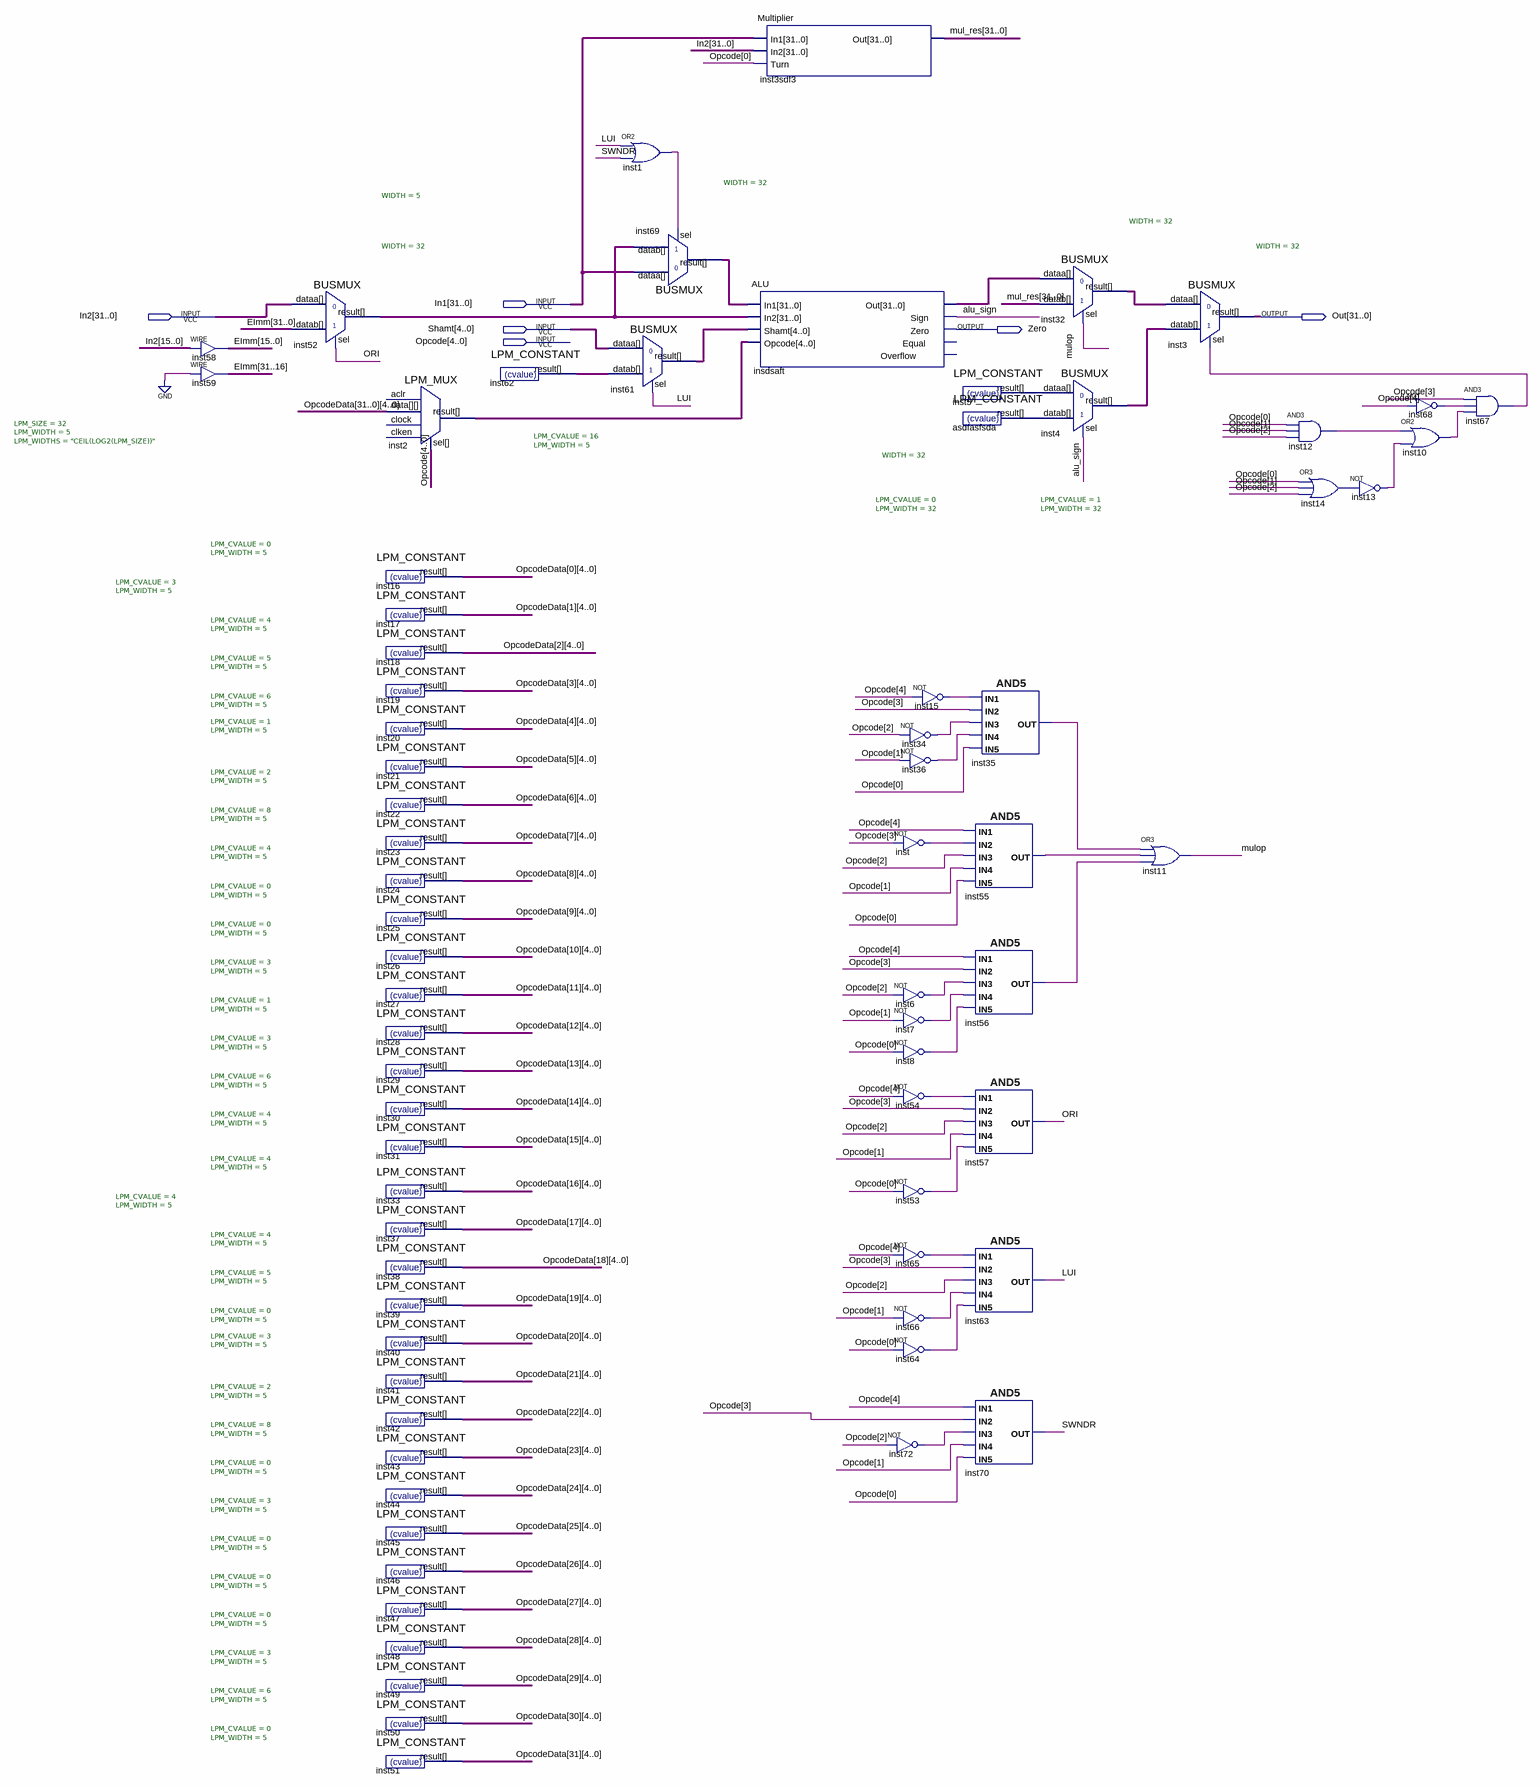
[diagram p0: schematic sheet]
// Quartus schematic ExtendedALU.bdf as structural Verilog: 73 symbols, 6 pins
module ExtendedALU (
  input  [31:0] In1,
  input  [31:0] In2,
  input  [4:0] Shamt,
  input  [4:0] Opcode,
  output [31:0] Out,
  output Zero
);

  wire alu_sign, inst1_out, inst6_out, inst7_out, inst8_out, inst10_out, inst12_out, inst13_out, inst14_out,
       inst15_out, inst34_out, inst35_out, inst36_out, inst53_out, inst54_out, inst55_out, inst56_out,
       inst64_out, inst65_out, inst66_out, inst67_out, inst68_out, inst72_out, inst_out, LUI, mulop, ORI,
       SWNDR;
  wire [4:0] inst2_result, inst61_result, inst62_result, OpcodeData_0, OpcodeData_1, OpcodeData_2,
       OpcodeData_3, OpcodeData_4, OpcodeData_5, OpcodeData_6, OpcodeData_7, OpcodeData_8, OpcodeData_9,
       OpcodeData_10, OpcodeData_11, OpcodeData_12, OpcodeData_13, OpcodeData_14, OpcodeData_15,
       OpcodeData_16, OpcodeData_17, OpcodeData_18, OpcodeData_19, OpcodeData_20, OpcodeData_21,
       OpcodeData_22, OpcodeData_23, OpcodeData_24, OpcodeData_25, OpcodeData_26, OpcodeData_27,
       OpcodeData_28, OpcodeData_29, OpcodeData_30, OpcodeData_31;
  wire [31:0] asdfasfsda_result, EImm, insdsaft_out, inst4_result, inst5_result, inst32_result,
       inst52_result, inst69_result, mul_res;

  assign EImm[15:0] = In2[15:0];  // WIRE inst58
  assign EImm[31:16] = {16{1'b0}};  // WIRE inst59
  BUSMUX #(.WIDTH(32)) inst52 (.datab(EImm), .sel(ORI), .dataa(In2), .result(inst52_result));
  LPM_CONSTANT #(.LPM_CVALUE(0), .LPM_WIDTH(5)) inst16 (.result(OpcodeData_0));
  LPM_CONSTANT #(.LPM_CVALUE(3), .LPM_WIDTH(5)) inst17 (.result(OpcodeData_1));
  LPM_CONSTANT #(.LPM_CVALUE(4), .LPM_WIDTH(5)) inst18 (.result(OpcodeData_2));
  LPM_CONSTANT #(.LPM_CVALUE(5), .LPM_WIDTH(5)) inst19 (.result(OpcodeData_3));
  LPM_CONSTANT #(.LPM_CVALUE(6), .LPM_WIDTH(5)) inst20 (.result(OpcodeData_4));
  LPM_CONSTANT #(.LPM_CVALUE(1), .LPM_WIDTH(5)) inst21 (.result(OpcodeData_5));
  LPM_CONSTANT #(.LPM_CVALUE(2), .LPM_WIDTH(5)) inst22 (.result(OpcodeData_6));
  LPM_CONSTANT #(.LPM_CVALUE(8), .LPM_WIDTH(5)) inst23 (.result(OpcodeData_7));
  LPM_CONSTANT #(.LPM_CVALUE(4), .LPM_WIDTH(5)) inst24 (.result(OpcodeData_8));
  LPM_CONSTANT #(.LPM_CVALUE(0), .LPM_WIDTH(5)) inst25 (.result(OpcodeData_9));
  LPM_CONSTANT #(.LPM_CVALUE(0), .LPM_WIDTH(5)) inst26 (.result(OpcodeData_10));
  LPM_CONSTANT #(.LPM_CVALUE(3), .LPM_WIDTH(5)) inst27 (.result(OpcodeData_11));
  LPM_CONSTANT #(.LPM_CVALUE(1), .LPM_WIDTH(5)) inst28 (.result(OpcodeData_12));
  LPM_CONSTANT #(.LPM_CVALUE(3), .LPM_WIDTH(5)) inst29 (.result(OpcodeData_13));
  LPM_CONSTANT #(.LPM_CVALUE(6), .LPM_WIDTH(5)) inst30 (.result(OpcodeData_14));
  LPM_CONSTANT #(.LPM_CVALUE(4), .LPM_WIDTH(5)) inst31 (.result(OpcodeData_15));
  LPM_CONSTANT #(.LPM_CVALUE(4), .LPM_WIDTH(5)) inst33 (.result(OpcodeData_16));
  LPM_CONSTANT #(.LPM_CVALUE(4), .LPM_WIDTH(5)) inst37 (.result(OpcodeData_17));
  LPM_CONSTANT #(.LPM_CVALUE(4), .LPM_WIDTH(5)) inst38 (.result(OpcodeData_18));
  LPM_CONSTANT #(.LPM_CVALUE(5), .LPM_WIDTH(5)) inst39 (.result(OpcodeData_19));
  LPM_CONSTANT #(.LPM_CVALUE(0), .LPM_WIDTH(5)) inst40 (.result(OpcodeData_20));
  LPM_CONSTANT #(.LPM_CVALUE(3), .LPM_WIDTH(5)) inst41 (.result(OpcodeData_21));
  LPM_CONSTANT #(.LPM_CVALUE(2), .LPM_WIDTH(5)) inst42 (.result(OpcodeData_22));
  LPM_CONSTANT #(.LPM_CVALUE(8), .LPM_WIDTH(5)) inst43 (.result(OpcodeData_23));
  LPM_CONSTANT #(.LPM_CVALUE(0), .LPM_WIDTH(5)) inst44 (.result(OpcodeData_24));
  LPM_CONSTANT #(.LPM_CVALUE(3), .LPM_WIDTH(5)) inst45 (.result(OpcodeData_25));
  LPM_CONSTANT #(.LPM_CVALUE(0), .LPM_WIDTH(5)) inst46 (.result(OpcodeData_26));
  LPM_CONSTANT #(.LPM_CVALUE(0), .LPM_WIDTH(5)) inst47 (.result(OpcodeData_27));
  LPM_CONSTANT #(.LPM_CVALUE(0), .LPM_WIDTH(5)) inst48 (.result(OpcodeData_28));
  LPM_CONSTANT #(.LPM_CVALUE(3), .LPM_WIDTH(5)) inst49 (.result(OpcodeData_29));
  LPM_CONSTANT #(.LPM_CVALUE(6), .LPM_WIDTH(5)) inst50 (.result(OpcodeData_30));
  LPM_CONSTANT #(.LPM_CVALUE(0), .LPM_WIDTH(5)) inst51 (.result(OpcodeData_31));
  LPM_MUX #(.LPM_SIZE(32), .LPM_WIDTH(5), .LPM_WIDTHS("CEIL(LOG2(LPM_SIZE))")) inst2 (
    .data({OpcodeData_31, OpcodeData_30, OpcodeData_29, OpcodeData_28, OpcodeData_27, OpcodeData_26, OpcodeData_25, OpcodeData_24, OpcodeData_23, OpcodeData_22, OpcodeData_21, OpcodeData_20, OpcodeData_19, OpcodeData_18, OpcodeData_17, OpcodeData_16, OpcodeData_15, OpcodeData_14, OpcodeData_13, OpcodeData_12, OpcodeData_11, OpcodeData_10, OpcodeData_9, OpcodeData_8, OpcodeData_7, OpcodeData_6, OpcodeData_5, OpcodeData_4, OpcodeData_3, OpcodeData_2, OpcodeData_1, OpcodeData_0}),
    .sel(Opcode), .result(inst2_result));  // open: clock, aclr, clken
  LPM_CONSTANT #(.LPM_CVALUE(16), .LPM_WIDTH(5)) inst62 (.result(inst62_result));
  or inst1 (inst1_out, LUI, SWNDR);
  BUSMUX #(.WIDTH(32)) inst69 (.datab(inst52_result), .sel(inst1_out), .dataa(In1), .result(inst69_result));
  BUSMUX #(.WIDTH(5)) inst61 (.datab(inst62_result), .sel(LUI), .dataa(Shamt), .result(inst61_result));
  Multiplier inst3sdf3 (.In1(In1), .In2(In2), .Turn(Opcode[0]), .Out(mul_res));
  ALU insdsaft (
    .In1(inst69_result), .In2(inst52_result), .Shamt(inst61_result), .Opcode(inst2_result),
    .Out(insdsaft_out), .Sign(alu_sign), .Zero(Zero));  // open: Equal, Overflow
  not inst72 (inst72_out, Opcode[2]);
  not inst15 (inst15_out, Opcode[4]);
  not inst34 (inst34_out, Opcode[2]);
  not inst36 (inst36_out, Opcode[1]);
  not inst (inst_out, Opcode[3]);
  not inst6 (inst6_out, Opcode[2]);
  not inst7 (inst7_out, Opcode[1]);
  not inst8 (inst8_out, Opcode[0]);
  not inst54 (inst54_out, Opcode[4]);
  not inst53 (inst53_out, Opcode[0]);
  not inst65 (inst65_out, Opcode[4]);
  not inst66 (inst66_out, Opcode[1]);
  not inst64 (inst64_out, Opcode[0]);
  LPM_CONSTANT #(.LPM_CVALUE(0), .LPM_WIDTH(32)) inst5 (.result(inst5_result));
  LPM_CONSTANT #(.LPM_CVALUE(1), .LPM_WIDTH(32)) asdfasfsda (.result(asdfasfsda_result));
  and inst35 (inst35_out, inst15_out, Opcode[3], inst34_out, inst36_out, Opcode[0]);
  and inst55 (inst55_out, Opcode[4], inst_out, Opcode[2], Opcode[1], Opcode[0]);
  and inst56 (inst56_out, Opcode[4], Opcode[3], inst6_out, inst7_out, inst8_out);
  and inst57 (ORI, inst54_out, Opcode[3], Opcode[2], Opcode[1], inst53_out);
  and inst63 (LUI, inst65_out, Opcode[3], Opcode[2], inst66_out, inst64_out);
  and inst70 (SWNDR, Opcode[4], Opcode[3], inst72_out, Opcode[1], Opcode[0]);
  BUSMUX #(.WIDTH(32)) inst32 (.datab(mul_res), .sel(mulop), .dataa(insdsaft_out), .result(inst32_result));
  BUSMUX #(.WIDTH(32)) inst4 (.datab(asdfasfsda_result), .sel(alu_sign), .dataa(inst5_result), .result(inst4_result));
  or inst11 (mulop, inst35_out, inst55_out, inst56_out);
  BUSMUX #(.WIDTH(32)) inst3 (.datab(inst4_result), .sel(inst67_out), .dataa(inst32_result), .result(Out));
  and inst12 (inst12_out, Opcode[0], Opcode[1], Opcode[2]);
  or inst14 (inst14_out, Opcode[0], Opcode[1], Opcode[2]);
  not inst13 (inst13_out, inst14_out);
  not inst68 (inst68_out, Opcode[4]);
  or inst10 (inst10_out, inst12_out, inst13_out);
  and inst67 (inst67_out, Opcode[3], inst68_out, inst10_out);
endmodule
